# EAGLE schematic AdamOBrien_IOT2_PicController (EAGLE 9.6.2)

## Sheet 1 of 2
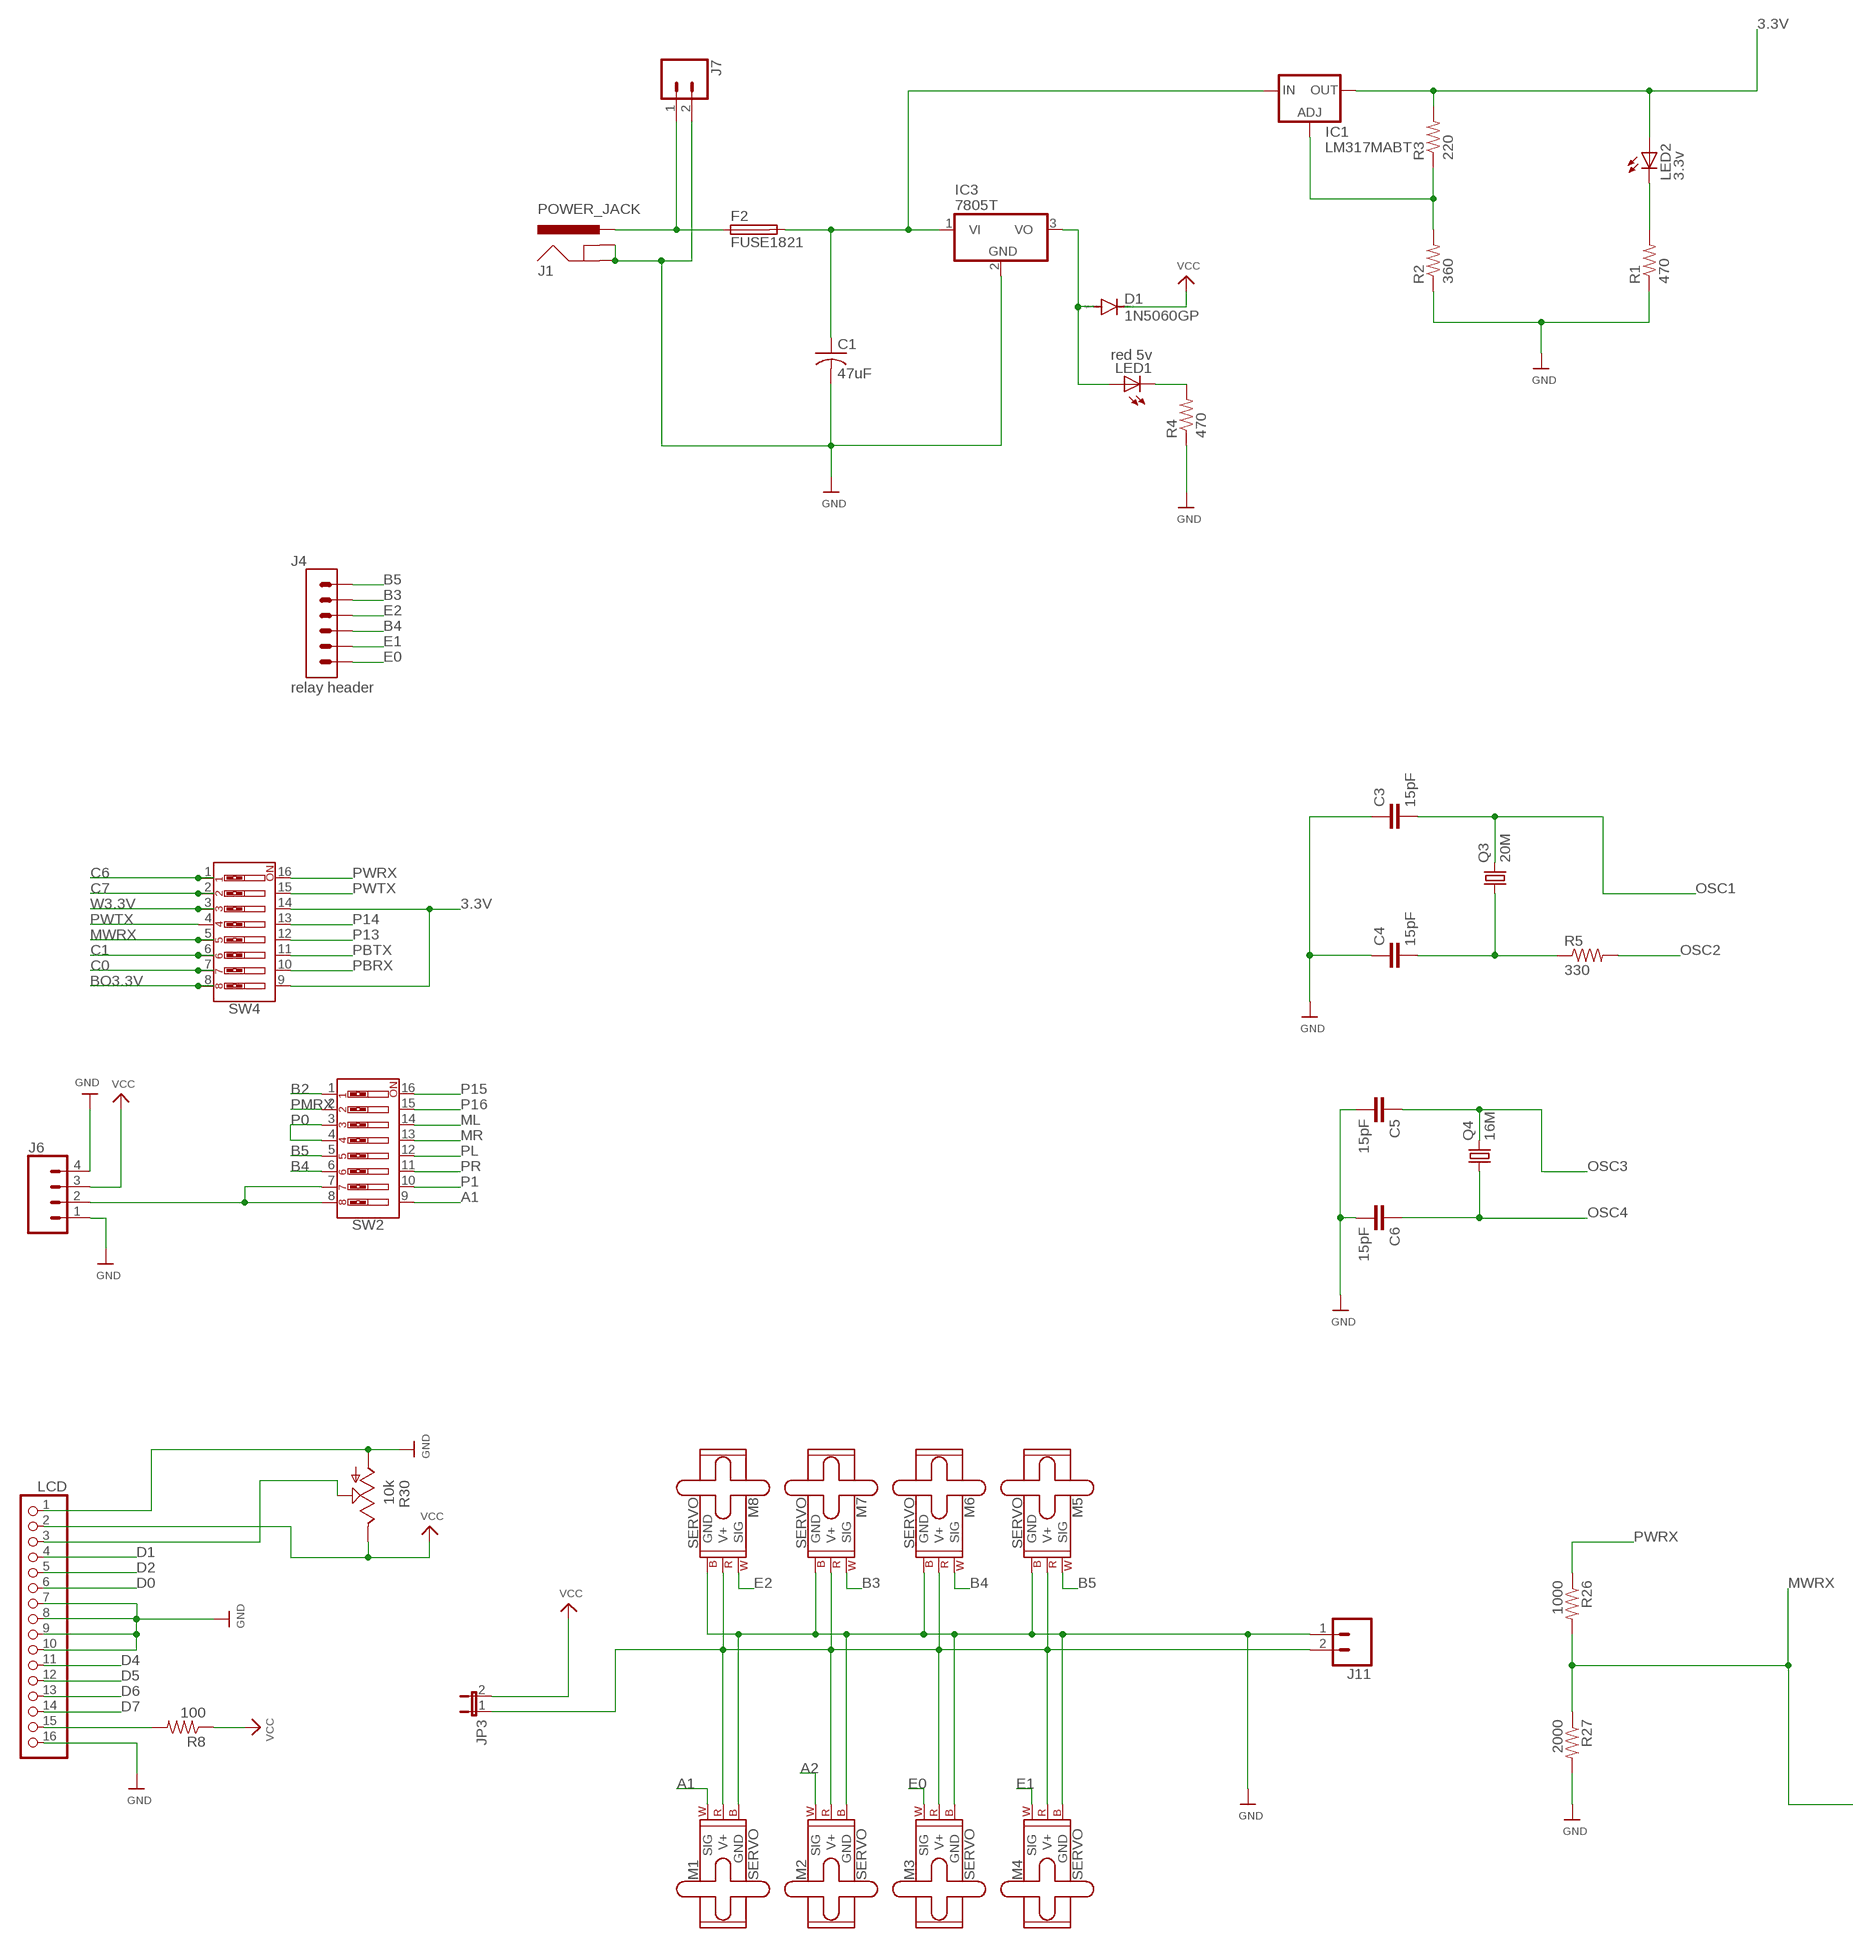
[diagram p0: schematic, sheet 1, part 1 of 2]
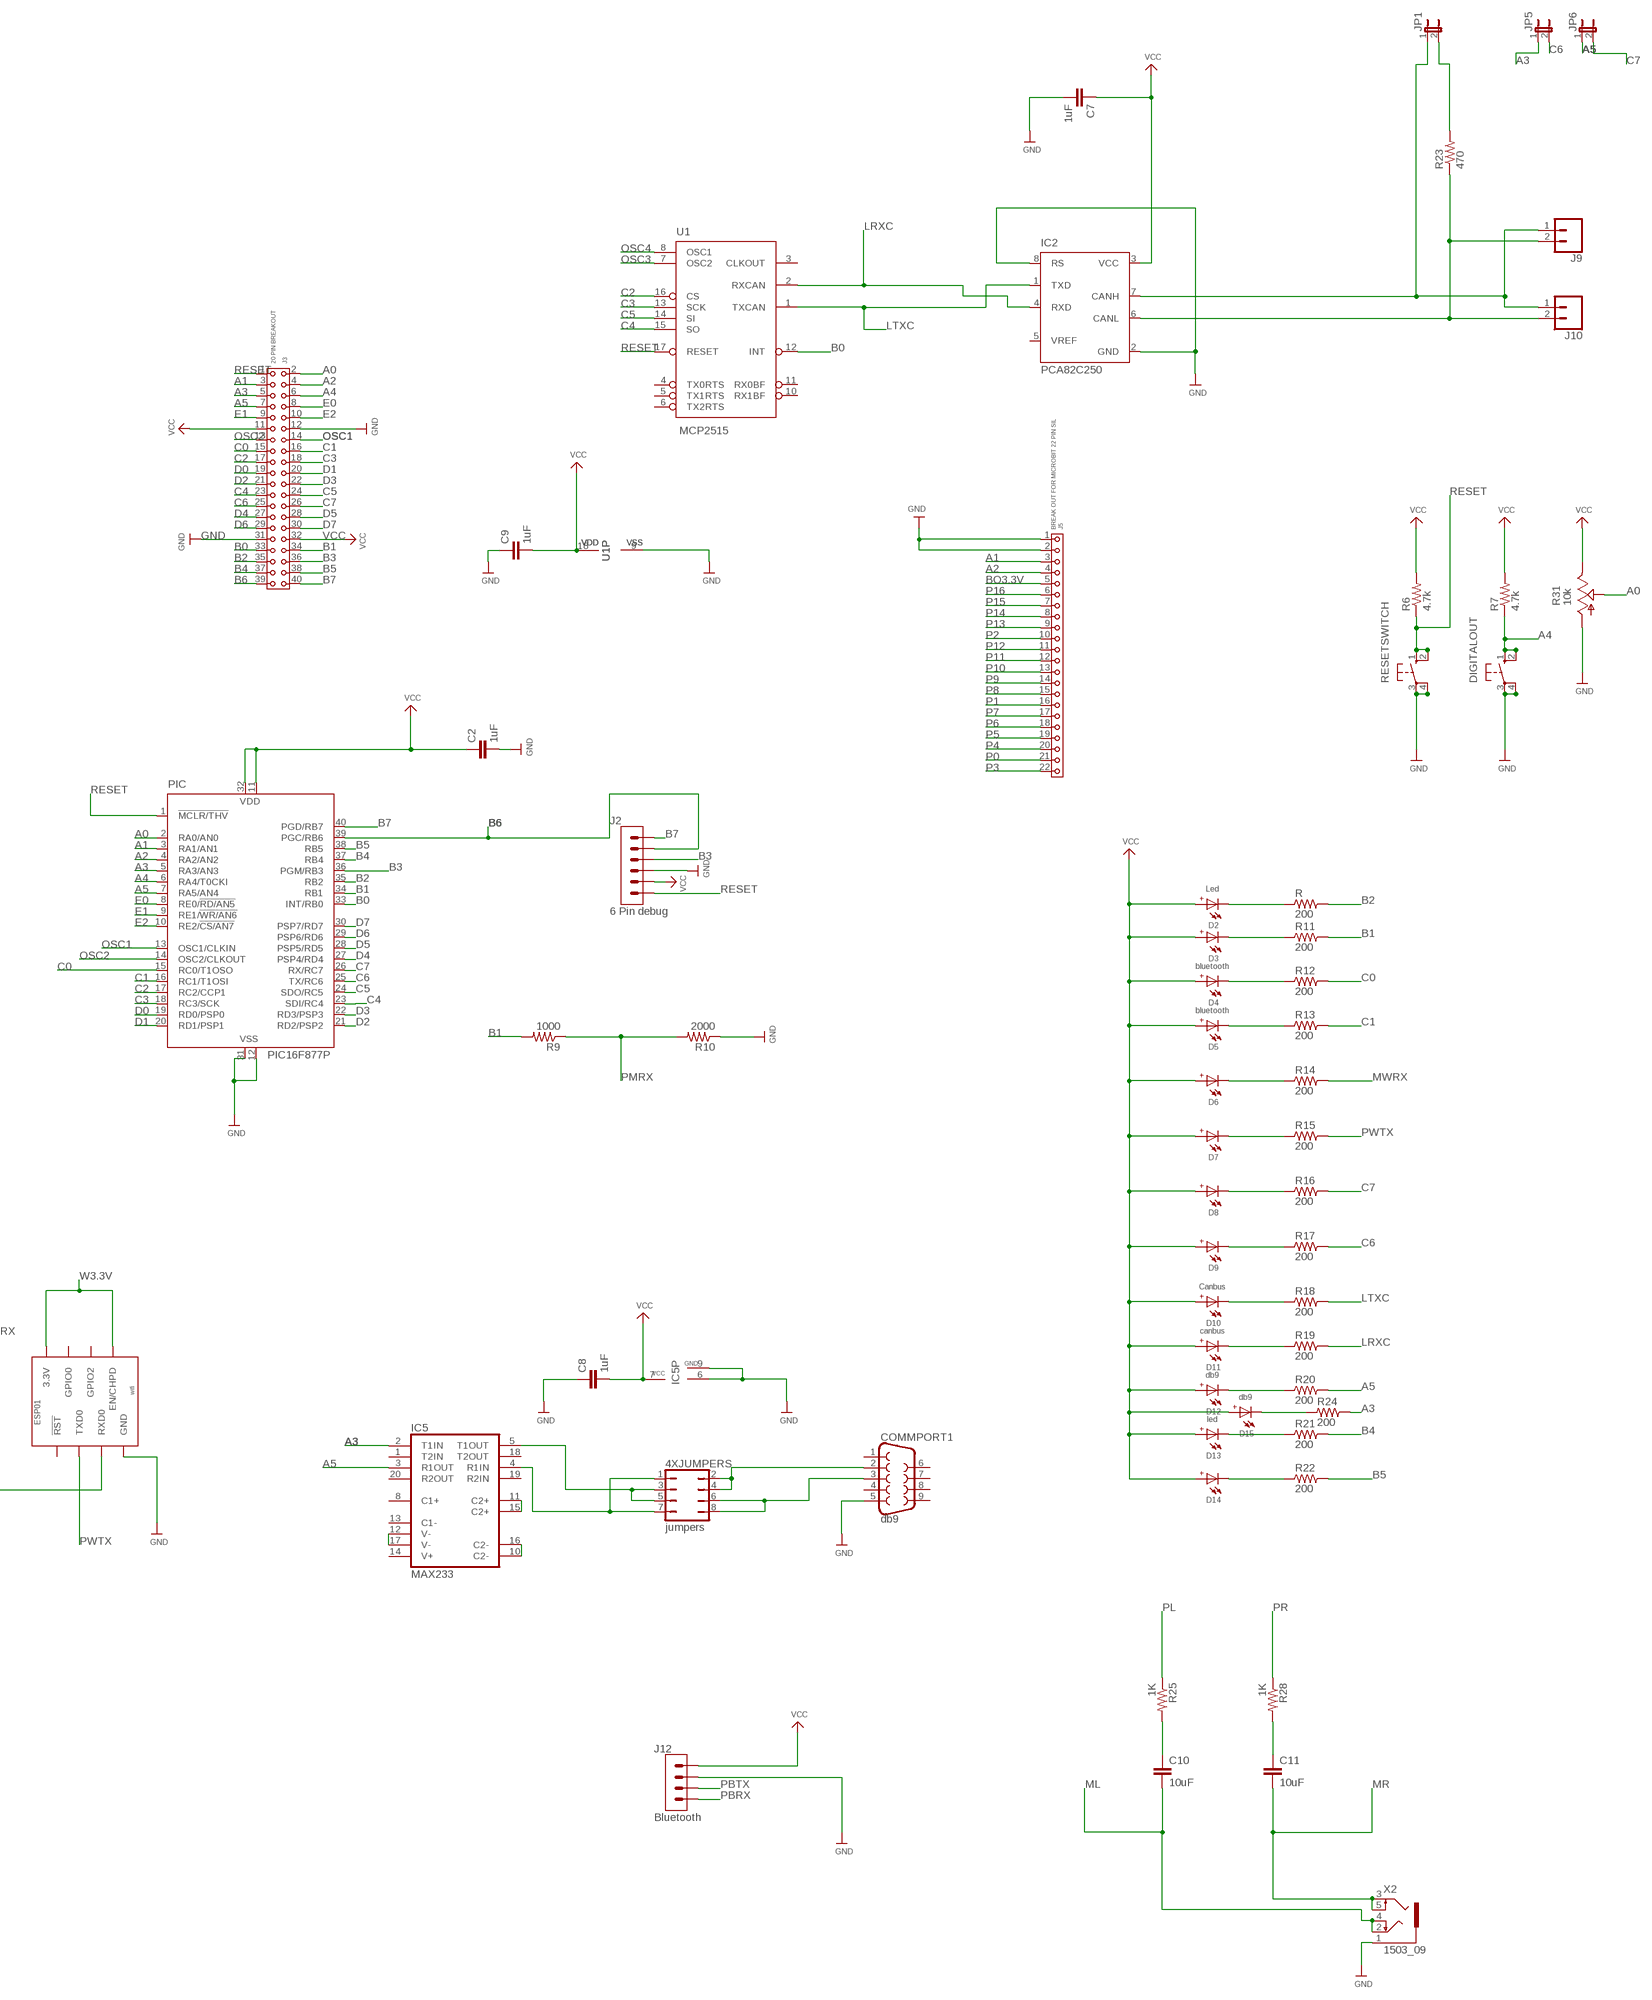
[diagram p1: schematic, sheet 1, part 2 of 2]

### Parts
4XJUMPERS  jumpers  JP4Q  [JP4Q]
C1  47uF  C-US025-024X044  [C025-024X044]
C2  1uF  C2.5/2  [C2.5-2]
C3  15pF  C2.5/2  [C2.5-2]
C4  15pF  C2.5/2  [C2.5-2]
C5  15pF  C2.5/2  [C2.5-2]
C6  15pF  C2.5/2  [C2.5-2]
C7  1uF  C2.5/2  [C2.5-2]
C8  1uF  C2.5/2  [C2.5-2]
C9  1uF  C2.5/2  [C2.5-2]
C10  10uF  C2.5/2  [C2.5-2]
C11  10uF  C2.5/2  [C2.5-2]
COMMPORT1  db9  DB9FEMALE  [DB9]
D1  1N5060GP  [DO15-12]
D2  Led  WL-SITW_3528_15414185BA210  [WL-SITW_3528]
D3  WL-SITW_3528_15414185BA210  [WL-SITW_3528]
D4  bluetooth  WL-SITW_3528_15414185BA210  [WL-SITW_3528]
D5  bluetooth  WL-SITW_3528_15414185BA210  [WL-SITW_3528]
D6  WL-SITW_3528_15414185BA210  [WL-SITW_3528]
D7  WL-SITW_3528_15414185BA210  [WL-SITW_3528]
D8  WL-SITW_3528_15414185BA210  [WL-SITW_3528]
D9  WL-SITW_3528_15414185BA210  [WL-SITW_3528]
D10  Canbus  WL-SITW_3528_15414185BA210  [WL-SITW_3528]
D11  canbus  WL-SITW_3528_15414185BA210  [WL-SITW_3528]
D12  db9  WL-SITW_3528_15414185BA210  [WL-SITW_3528]
D13  led  WL-SITW_3528_15414185BA210  [WL-SITW_3528]
D14  WL-SITW_3528_15414185BA210  [WL-SITW_3528]
D15  db9  WL-SITW_3528_15414185BA210  [WL-SITW_3528]
DIGITALOUT  10-XX  [B3F-10XX]
ESP01  wifi  ESP8266_ESP-01  [ESP8266_ESP-01_NO-SILKSCREEN]
F2  FUSE1821  [FUSE_HOLDER_MENTOR-1821]
IC1  LM317MABT  [TO220L1]
IC2  PCA82C250  [DIL08]
IC3  7805T  [TO220H]
IC5  MAX233  [DIL20]
J1  POWER_JACK  [POWER_JACK_PTH]
J2  6 Pin debug  62000611121  [62000611121]
J3  20 PIN BREAKOUT  6130XX21821_61304021821  [61304021821]
J4  relay header  62000611121  [62000611121]
J5  BREAK OUT FOR MICROBIT 22 PIN SIL  6130XX11821_61302211821  [61302211821]
J6  CONN_04  [1X04]
J7  CONN_025MM  [SCREWTERMINAL-5MM-2]
J9  CONN_025MM  [SCREWTERMINAL-5MM-2]
J10  CONN_025MM  [SCREWTERMINAL-5MM-2]
J11  CONN_025MM  [SCREWTERMINAL-5MM-2]
J12  Bluetooth  62000411121  [62000411121]
JP1  JP1E  [JP1]
JP3  JP1E  [JP1]
JP5  JP1E  [JP1]
JP6  JP1E  [JP1]
LCD  PINHD-1X16  [1X16]
LED1  red 5v  LED5MM  [LED5MM]
LED2  3.3v  LED5MM  [LED5MM]
M1  SERVO  [1X03]
M2  SERVO  [1X03]
M3  SERVO  [1X03]
M4  SERVO  [1X03]
M5  SERVO  [1X03]
M6  SERVO  [1X03]
M7  SERVO  [1X03]
M8  SERVO  [1X03]
PIC  PIC16F877P  [DIL40]
Q3  20M  CRYSTALHC49S  [HC49/S]
Q4  16M  CRYSTALHC49S  [HC49/S]
R  200  RC-MASTER-SMD_R_1206MP  [RC-MASTER-SMD_R1206MP]
R1  470  R-US_0204/7  [0204/7]
R2  360  R-US_0204/7  [0204/7]
R3  220  R-US_0204/7  [0204/7]
R4  470  R-US_0204/7  [0204/7]
R5  330  R-US_0204/7  [0204/7]
R6  4.7k  R-US_0204/7  [0204/7]
R7  4.7k  R-US_0204/7  [0204/7]
R8  100  R-US_0204/7  [0204/7]
R9  1000  R-US_0204/7  [0204/7]
R10  2000  R-US_0204/7  [0204/7]
R11  200  RC-MASTER-SMD_R_1206MP  [RC-MASTER-SMD_R1206MP]
R12  200  RC-MASTER-SMD_R_1206MP  [RC-MASTER-SMD_R1206MP]
R13  200  RC-MASTER-SMD_R_1206MP  [RC-MASTER-SMD_R1206MP]
R14  200  RC-MASTER-SMD_R_1206MP  [RC-MASTER-SMD_R1206MP]
R15  200  RC-MASTER-SMD_R_1206MP  [RC-MASTER-SMD_R1206MP]
R16  200  RC-MASTER-SMD_R_1206MP  [RC-MASTER-SMD_R1206MP]
R17  200  RC-MASTER-SMD_R_1206MP  [RC-MASTER-SMD_R1206MP]
R18  200  RC-MASTER-SMD_R_1206MP  [RC-MASTER-SMD_R1206MP]
R19  200  RC-MASTER-SMD_R_1206MP  [RC-MASTER-SMD_R1206MP]
R20  200  RC-MASTER-SMD_R_1206MP  [RC-MASTER-SMD_R1206MP]
R21  200  RC-MASTER-SMD_R_1206MP  [RC-MASTER-SMD_R1206MP]
R22  200  RC-MASTER-SMD_R_1206MP  [RC-MASTER-SMD_R1206MP]
R23  470  R-US_0204/7  [0204/7]
R24  200  RC-MASTER-SMD_R_1206MP  [RC-MASTER-SMD_R1206MP]
R25  1K  R-US_0204/7  [0204/7]
R26  1000  R-US_0204/7  [0204/7]
R27  2000  R-US_0204/7  [0204/7]
R28  1K  R-US_0204/7  [0204/7]
R30  10k  TRIM_US-RS3  [RS3]
R31  10k  TRIM_US-RS3  [RS3]
RESETSWITCH  10-XX  [B3F-10XX]
SW2  DIP-08-PTH  [DIPSWITCH-08]
SW4  DIP-08-PTH  [DIPSWITCH-08]
U1  MCP2515  MCP2515(MCP2510)P  [DIP18]
X2  1503_09  [1503_09]

### Nets
3.3V: IC1.2(OUT) LED2.A R3.2 SW4.9 SW4.14
A0: J3.2 PIC.2(RA0/AN0) R31.S
A1: J3.3 J5.3 M1.1(SIG) PIC.3(RA1/AN1) SW2.9
A2: J3.4 J5.4 M2.1(SIG) PIC.4(RA2/AN2)
A3: IC5.2(T1IN) J3.5 JP5.1 PIC.5(RA3/AN3) R24.2
A4: DIGITALOUT.1(S) DIGITALOUT.2(S1) J3.6 PIC.6(RA4/T0CKI) R7.1
A5: IC5.3(R1OUT) J3.7 JP6.1 PIC.7(RA5/AN4) R20.2
B0: J3.33 PIC.33(INT/RB0) U1.12(INT)
B1: J3.34 PIC.34(RB1) R9.2 R11.2
B2: J3.35 PIC.35(RB2) R.2 SW2.1
B3: J2.3 J3.36 J4.2 M7.1(SIG) PIC.36(PGM/RB3)
B4: J3.37 J4.4 M6.1(SIG) PIC.37(RB4) R21.2 SW2.6
B5: J3.38 J4.1 M5.1(SIG) PIC.38(RB5) R22.2 SW2.5
B6: J2.2 J3.39 PIC.39(PGC/RB6)
B7: J2.1 J3.40 PIC.40(PGD/RB7)
BO3.3V: J5.5 SW4.8
C0: J3.15 PIC.15(RC0/T1OSO) R12.2 SW4.7
C1: J3.16 PIC.16(RC1/T1OSI) R13.2 SW4.6
C2: J3.17 PIC.17(RC2/CCP1) U1.16(CS)
C3: J3.18 PIC.18(RC3/SCK) U1.13(SCK)
C4: J3.23 PIC.23(SDI/RC4) U1.15(SO)
C5: J3.24 PIC.24(SDO/RC5) U1.14(SI)
C6: J3.25 JP5.2 PIC.25(TX/RC6) R17.2 SW4.1
C7: J3.26 JP6.2 PIC.26(RX/RC7) R16.2 SW4.2
D0: J3.19 LCD.6 PIC.19(RD0/PSP0)
D1: J3.20 LCD.4 PIC.20(RD1/PSP1)
D2: J3.21 LCD.5 PIC.21(RD2/PSP2)
D3: J3.22 PIC.22(RD3/PSP3)
D4: J3.27 LCD.11 PIC.27(PSP4/RD4)
D5: J3.28 LCD.12 PIC.28(PSP5/RD5)
D6: J3.29 LCD.13 PIC.29(PSP6/RD6)
D7: J3.30 LCD.14 PIC.30(PSP7/RD7)
E0: J3.8 J4.6 M3.1(SIG) PIC.8(RE0/!RD/AN5)
E1: J3.9 J4.5 M4.1(SIG) PIC.9(RE1/!WR/AN6)
E2: J3.10 J4.3 M8.1(SIG) PIC.10(RE2/!CS/AN7)
GND: C1.2 C2.2 C3.1 C4.1 C5.2 C6.2 C7.2 C8.1 C9.1 COMMPORT1.5 DIGITALOUT.3(P) DIGITALOUT.4(P1) ESP01.GND IC2.2(GND) IC2.8(RS) IC3.2(GND) IC5.6(GND) IC5.9(GND) J1.GND J1.GNDBREAK J2.4 J3.12 J3.31 J5.1 J5.2 J6.1 J6.4 J7.2 J11.1 J12.2 LCD.1 LCD.7 LCD.8 LCD.9 LCD.10 LCD.16 M1.3(GND) M2.3(GND) M3.3(GND) M4.3(GND) M5.3(GND) M6.3(GND) M7.3(GND) M8.3(GND) PIC.12(VSS) PIC.31(VSS) R1.1 R2.1 R4.1 R10.1 R27.2 R30.A R31.A RESETSWITCH.3(P) RESETSWITCH.4(P1) U1.9(VSS) X2.1
LRXC: IC2.4(RXD) R19.2 U1.2(RXCAN)
LTXC: IC2.1(TXD) R18.2 U1.1(TXCAN)
ML: C10.2 SW2.14 X2.2 X2.4
MR: C11.2 SW2.13 X2.3 X2.5
MWRX: ESP01.RX(RXD0) R14.2 R26.2 R27.1 SW4.5
N$1: F2.A J1.PWR J7.1
N$2: C1.1 F2.B IC1.3(IN) IC3.1(VI)
N$3: LED1.K(C) R4.2
N$4: J6.2 SW2.7 SW2.8
N$5: LED2.K(C) R1.2
N$6: D1.A IC3.3(VO) LED1.A
N$7: IC1.1(ADJ) R2.2 R3.1
N$8: C4.2 Q3.1 R5.1
N$9: IC2.7(CANH) J9.1 J10.1 JP1.1
N$10: D2.2(-) R.1
N$11: D3.2(-) R11.1
N$12: JP1.2 R23.2
N$13: D4.2(-) R12.1
N$15: LCD.3 R30.S
N$16: D5.2(-) R13.1
N$17: LCD.15 R8.2
N$18: D15.2(-) R24.1
N$19: D6.2(-) R14.1
N$25: D7.2(-) R15.1
N$27: D8.2(-) R16.1
N$28: C10.1 R25.2
N$29: D9.2(-) R17.1
N$33: D10.2(-) R18.1
N$41: D11.2(-) R19.1
N$42: D12.2(-) R20.1
N$43: D13.2(-) R21.1
N$44: D14.2(-) R22.1
N$46: IC2.6(CANL) J9.2 J10.2 R23.1
N$47: 4XJUMPERS.6 4XJUMPERS.8 COMMPORT1.3
N$48: 4XJUMPERS.2 4XJUMPERS.4 COMMPORT1.2
N$49: 4XJUMPERS.3 4XJUMPERS.5 IC5.5(T1OUT)
N$50: J11.2 JP3.1 M1.2(V+) M2.2(V+) M3.2(V+) M4.2(V+) M5.2(V+) M6.2(V+) M7.2(V+) M8.2(V+)
N$52: 4XJUMPERS.1 4XJUMPERS.7 IC5.4(R1IN)
N$53: IC5.11(C2+) IC5.15(C2+)
N$54: IC5.10(C2-) IC5.16(C2-)
N$55: IC5.12(V-) IC5.17(V-)
N$57: C11.1 R28.2
OSC1: C3.2 J3.14 PIC.13(OSC1/CLKIN) Q3.2
OSC2: J3.13 PIC.14(OSC2/CLKOUT) R5.2
OSC3: C5.1 Q4.2 U1.7(OSC2)
OSC4: C6.1 Q4.1 U1.8(OSC1)
P0: J5.21 SW2.3 SW2.4
P1: J5.16 SW2.10
P2: J5.10
P3: J5.22
P4: J5.20
P5: J5.19
P6: J5.18
P7: J5.17
P8: J5.15
P9: J5.14
P10: J5.13
P11: J5.12
P12: J5.11
P13: J5.9 SW4.12
P14: J5.8 SW4.13
P15: J5.7 SW2.16
P16: J5.6 SW2.15
PBRX: J12.4 SW4.10
PBTX: J12.3 SW4.11
PL: R25.1 SW2.12
PMRX: R9.1 R10.2 SW2.2
PR: R28.1 SW2.11
PWRX: R26.1 SW4.16
PWTX: ESP01.TX(TXD0) R15.2 SW4.4 SW4.15
RESET: J2.6 J3.1 PIC.1(!MCLR/THV) R6.1 RESETSWITCH.1(S) RESETSWITCH.2(S1) U1.17(RESET)
VCC: C2.1 C7.1 C8.2 C9.2 D1.C D2.1(+) D3.1(+) D4.1(+) D5.1(+) D6.1(+) D7.1(+) D8.1(+) D9.1(+) D10.1(+) D11.1(+) D12.1(+) D13.1(+) D14.1(+) D15.1(+) IC2.3(VCC) IC5.7(VCC) J2.5 J3.11 J3.32 J6.3 J12.1 JP3.2 LCD.2 PIC.11(VDD) PIC.32(VDD) R6.2 R7.2 R8.1 R30.E R31.E U1.18(VDD)
W3.3V: ESP01.3V3(3.3V) ESP01.EN/CH_PD(EN/CHPD) SW4.3
Unconnected: COMMPORT1.1 COMMPORT1.4 COMMPORT1.6 COMMPORT1.7 COMMPORT1.8 COMMPORT1.9 ESP01.GPIO0 ESP01.GPIO2 ESP01.RST(!RST!) IC2.5(VREF) IC5.1(T2IN) IC5.8(C1+) IC5.13(C1-) IC5.14(V+) IC5.18(T2OUT) IC5.19(R2IN) IC5.20(R2OUT) U1.3(CLKOUT) U1.4(TX0RTS) U1.5(TX1RTS) U1.6(TX2RTS) U1.10(RX1BF) U1.11(RX0BF)

## Sheet 2 of 2

## Library data of the parts
4XJUMPERS = jumper:JP4Q: JUMPER
C1 = adafruit:C-US: CAPACITOR, American symbol
C2-C11 = capacitor-wima:C: CAPACITOR naming: grid - package width
COMMPORT1 = SparkFun-Connectors:DB9: DB9 Connector Standard DB9 (D-Sub 9) serial connector. Can be used for CAN bus as well as RS485 and RS232. Footprint production proven. Here is the female version connector we sell at SparkFun: 9 Pin Female Serial Connector - PCB Mount <https://www.sparkfun.com/products/429> (PRT-00429) This connector has been used on the following SparkFun products: SparkFun RS232 Shifter - SMD <https://www.sparkfun.com/products/449> (PRT-00449) SparkFun RS232 Shifter SMD (No DB9) <https://www.sparkfun.com/products/8780> (PRT-08780); PROD_ID: CONN-08194
D1 = diode:1N5060GP: DIODE controlled avalanche rectifier
D2-D15 = Wurth_Infrared_WL-SITW:WL-SITW_3528: WL-SITW SMT Infrared TOP LED Waterclear Characteristics Standard size 3528 Low energy consumption High reliability Low current requirement Fast switching IR Emitter Applications Infrared sensor Distance measure Remote control IR Lightbarrier Smoke detector <https://www.we-online.com/catalog/media/o121487v209%20Family_SITW-3528_15414185BA220.jpg> Details see: https://www.we-online.com/catalog/en/WL-SITW/ Updated By Yingchun Shan 2020-03-24 2020 (C) Wurth Elektronik; ABSTRAHLWINKEL: 120°; CHIP-TECHNOLOGY: AlGaAs; DATASHEET-URL: https://www.we-online.com/catalog/datasheet/15414185BA210.pdf; EMITTING-COLOR: Infrared; H: 1.9mm; I-E-MIN: 5mW/sr; I-E-TYP: 9mW/sr; LAMDA-CENTROLD-TYP: 845nm; LAMDA-PEAK-TYP: 850nm; PART-NUMBER: 15414185BA210; V-F-MAX: 2V; V-F-TYP: 1.5V
DIGITALOUT RESETSWITCH = switch-omron:10-XX: OMRON SWITCH; MPN: B3F-1000; OC_FARNELL: 176432; OC_NEWARK: 36M3542
ESP01 = LuisLab-Boards:ESP8266_ESP-?
F2 = fuse:FUSE: Fuse; OC_FARNELL: unknown; OC_NEWARK: unknown
IC1 = v-reg:LM317?*: 500 mA Adjustable Output Positive Voltage Regulator Source: http://www.onsemi.co.jp .. LM317M-D.PDF
IC2 = micro-philips:PCA82C250: CAN CONTROLLER INTERFACE; OC_FARNELL: 3692358; OC_NEWARK: unknown
IC3 = linear:78*: Positive VOLTAGE REGULATOR Source: http://cache.national.com/ds/LM/LM78L05.pdf http://www.fairchildsemi.com/ds/LM/LM7805.pdf
IC5 = maxim:MAX233: RS232 TRANSCEIVER; MPN: MAX233ACPP+G36; OC_FARNELL: 1593332; OC_NEWARK: 89K3459
J1 = SparkFun-Connectors:POWER_JACK: Power Jack Connector This is the standard 5.5mm barrel jack for power. The PTH is the most common, proven, reliable, footprint. The Slot footprint only works if the mill layer is transmitted to the PCB fab house so be warned. Here are the connectors we sell at SparkFun: DC Barrel Power Jack/Connector <https://www.sparkfun.com/products/119> (PRT-00119) DC Barrel Power Jack/Connector (SMD) <https://www.sparkfun.com/products/12748> (PRT-12748) DC Barrel Jack Adapter - Breadboard Compatible <https://www.sparkfun.com/products/10811> (PRT-10811) It is used on this SparkFun product (and many, many others): SparkFun RedBoard - Programmed with Arduino <https://www.sparkfun.com/products/12757> (DEV-12757) Also, if you need a mating power supply or connector, please check these out: Wall Adapter Power Supply - 9VDC 650mA <https://www.sparkfun.com/products/298> (TOL-00298) DC Barrel Jack Adapter - Male <https://www.sparkfun.com/products/10287> (PRT-10287); PROD_ID: CONN-08197
J2 J4 = Headers:62000611121: THT Vertical Pin Header WR-PHD, Pitch 2.00 mm, Single Row, 6 pins Manufacturer's datasheet <https://datasheet.octopart.com/62000611121-W%C3%BCrth-Elektronik-datasheet-117282008.pdf>; CREATED_BY: PCBLayout.com; MANUFACTURER: Würth Elektronik; MPN: 62000611121
J3 = Wurth_Connectors_WR-PHD:6130XX21821_61304021821: WR-PHD 2.54 mm Dual Socket Header ARTICLE PROPERTIES: Pins:4;​ 6;​ 8;​ 10;​ 12;​ 14;​ 16;​ 18;​ 20;​ 22;​ 24;​ 26;​ 28;​ 30;​ 32;​ 34;​ 36;​ 40;​ 44;​ 64;​ 72 KIND PROPERTIES: Pitch：2.54 mm Quality Class:3 as per CECC 75 301-802 Rows：Dual Gender：Socket Header Type：Straight MATERIAL PROPERTIES: Insulator Material :PBT Insulator Flammability Rating:UL94 V-0 Contact Material:Copper Alloy Contact Plating:Gold Contact Type:Stamped GENERAL INFORMATION Operating Temperature:-40 up to +125 °C Compliance:Lead free / RoHS ELECTRICAL PROPERTIES: Rated Current:3 A IR 1:3 A Withstanding Voltage:500 V (AC) Contact Resistance:20 mΩ RISO:1000 MΩ CERTIFICATION UL Approval:E323964 PACKAGING PROPERTIES Packaging:Tray <https://katalog.we-online.com/media/images/v2/o57948v209%20Family_Dual_Socket_Header_WR-PHD_6130xx21821.jpg> Details see: https://katalog.we-online.com/en/em/PHD_2_54_DUAL_SOCKET_HEADER_6130XX21821 Updated by Yingchun,Shan 2019-10-21 2019 (C) Würth Elektronik; DATASHEET-URL: https://katalog.we-online.com/em/datasheet/61304021821.pdf; GENDER: Socket Header; IR: 3A; MATES: WR-PHD 2.54mm SMT Dual Pin Header/THT Angled Dual Pin Header/THT Dual Board Stacker/THT Dual Pin Header; PACKAGING: Tray; PART-NUMBER: 61304021821; PINS: 40; ROWS: Dual; TYPE: Straight
J5 = Wurth_Connectors_WR-PHD:6130XX11821_61302211821: WR-PHD 2.54 mm Socket Header ARTICLE PROPERTIES: Pins:1;​ 2;​ 3;​ 4;​ 5;​ 6;​ 7;​ 8;​ 9;​ 10;​ 12;​ 13;​ 14;​ 15;​ 16;​ 18;​ 20;​ 22;​ 24;​ 25;​ 32;​ 36;​ 40 KIND PROPERTIES: Pitch：2.54 mm Quality Class:3 as per CECC 75 301-802 Rows：Single Gender：Socket Header;​ Female Type：Straight MATERIAL PROPERTIES: Insulator Material :PBT Insulator Flammability Rating:UL94 V-0 Contact Material:Copper Alloy Contact Plating:Gold Contact Type:Stamped GENERAL INFORMATION Operating Temperature:-40 up to +125 °C Compliance:Lead free / RoHS ELECTRICAL PROPERTIES: Rated Current:3 A IR 1:3 A Withstanding Voltage:500 V (AC) Contact Resistance:20 mΩ RISO:1000 MΩ CERTIFICATION UL Approval:E323964 PACKAGING PROPERTIES Packaging:Tray <https://katalog.we-online.com/media/images/v2/o33218v209%20Family_WR-PHD_613xxx11821.jpg> Details see: https://katalog.we-online.com/en/em/PHD_2_54_SOCKET_HEADER_6130XX11821 Updated by Yingchun,Shan 2019-10-21 2019 (C) Würth Elektronik; DATASHEET-URL: https://katalog.we-online.com/em/datasheet/61302211821.pdf; GENDER: Socket Header; IR: 3A; MATES: WR-PHD 2.54mm SMT Pin Header/THT Angled Pin Header/THT Pin Header; PACKAGING: Tray; PART-NUMBER: 61302211821; PINS: 22; ROWS: Single; TYPE: Straight
J6 = SparkFun-Connectors:CONN_04: Multi connection point. Often used as Generic Header-pin footprint for 0.1 inch spaced/style header connections On any of the 0.1 inch spaced packages, you can populate with these: Break Away Headers - Straight <https://www.sparkfun.com/products/116> (PRT-00116) Break Away Male Headers - Right Angle <https://www.sparkfun.com/products/553> (PRT-00553) Female Headers <https://www.sparkfun.com/products/115> (PRT-00115) Break Away Headers - Machine Pin <https://www.sparkfun.com/products/117> (PRT-00117) Break Away Female Headers - Swiss Machine Pin <https://www.sparkfun.com/products/743> (PRT-00743) For SCREWTERMINALS and SPRING TERMINALS visit here: Screw Terimnals on SparkFun.com <https://www.sparkfun.com/search/results?term=Screw+Terminals> (5mm/3.5mm/2.54mm spacing) This device is also useful as a general connection point to wire up your design to another part of your project. Our various solder wires solder well into these plated through hole pads. Hook-Up Wire - Assortment (Stranded, 22 AWG) <https://www.sparkfun.com/products/11375> (PRT-11375) Hook-Up Wire - Assortment (Solid Core, 22 AWG) <https://www.sparkfun.com/products/11367> (PRT-11367) View the entire wire category on our website here <https://www.sparkfun.com/categories/141> Special notes: Molex polarized connector foot print use with SKU : PRT-08231 with associated crimp pins and housings. 1MM SMD Version SKU: PRT-10208; PROD_ID: CONN-09696
J7 J9-J11 = SparkFun-Connectors:CONN_02: Multi connection point. Often used as Generic Header-pin footprint for 0.1 inch spaced/style header connections On any of the 0.1 inch spaced packages, you can populate with these: Break Away Headers - Straight <https://www.sparkfun.com/products/116> (PRT-00116) Break Away Male Headers - Right Angle <https://www.sparkfun.com/products/553> (PRT-00553) Female Headers <https://www.sparkfun.com/products/115> (PRT-00115) Break Away Headers - Machine Pin <https://www.sparkfun.com/products/117> (PRT-00117) Break Away Female Headers - Swiss Machine Pin <https://www.sparkfun.com/products/743> (PRT-00743) For SCREWTERMINALS and SPRING TERMINALS visit here: Screw Terimnals on SparkFun.com <https://www.sparkfun.com/search/results?term=Screw+Terminals> (5mm/3.5mm/2.54mm spacing) This device is also useful as a general connection point to wire up your design to another part of your project. Our various solder wires solder well into these plated through hole pads. Hook-Up Wire - Assortment (Stranded, 22 AWG) <https://www.sparkfun.com/products/11375> (PRT-11375) Hook-Up Wire - Assortment (Solid Core, 22 AWG) <https://www.sparkfun.com/products/11367> (PRT-11367) View the entire wire category on our website here <https://www.sparkfun.com/categories/141> Special notes: Molex polarized connector foot print use with: PRT-08233 with associated crimp pins and housings. 2.54_SCREWTERM for use with PRT-10571. 3.5mm Screw Terminal footprints for PRT-08084 5mm Screw Terminal footprints for use with PRT-08432; SF_SKU: PRT-08432
J12 = Headers:62000411121: THT Vertical Pin Header WR-PHD, Pitch 2.00 mm, Single Row, 4 pins Manufacturer's datasheet <https://datasheet.octopart.com/62000411121-W%C3%BCrth-Elektronik-datasheet-117282003.pdf>; CREATED_BY: PCBLayout.com; MANUFACTURER: Würth Elektronik; MPN: 62000411121
JP1 JP3 JP5 JP6 = jumper:JP1E: JUMPER
LCD = pinhead:PINHD-1X16: PIN HEADER
LED1 LED2 = adafruit:LED: LED OSRAM: - CHIPLED LG R971, LG N971, LY N971, LG Q971, LY Q971, LO R971, LY R971 LH N974, LH R974 LS Q976, LO Q976, LY Q976 LO Q996 - Hyper CHIPLED LW Q18S LB Q993, LB Q99A, LB R99A - SideLED LS A670, LO A670, LY A670, LG A670, LP A670 LB A673, LV A673, LT A673, LW A673 LH A674 LY A675 LS A676, LA A676, LO A676, LY A676, LW A676 LS A679, LY A679, LG A679 - Hyper Micro SIDELED® LS Y876, LA Y876, LO Y876, LY Y876 LT Y87S - SmartLED LW L88C, LW L88S LB L89C, LB L89S, LG L890 LS L89K, LO L89K, LY L89K LS L896, LA L896, LO L896, LY L896 - TOPLED LS T670, LO T670, LY T670, LG T670, LP T670 LSG T670, LSP T670, LSY T670, LOP T670, LYG T670 LG T671, LOG T671, LSG T671 LB T673, LV T673, LT T673, LW T673 LH T674 LS T676, LA T676, LO T676, LY T676, LB T676, LH T676, LSB T676, LW T676 LB T67C, LV T67C, LT T67C, LS T67K, LO T67K, LY T67K, LW E67C LS E67B, LA E67B, LO E67B, LY E67B, LB E67C, LV E67C, LT E67C LW T67C LS T679, LY T679, LG T679 LS T770, LO T770, LY T770, LG T770, LP T770 LB T773, LV T773, LT T773, LW T773 LH T774 LS E675, LA E675, LY E675, LS T675 LS T776, LA T776, LO T776, LY T776, LB T776 LHGB T686 LT T68C, LB T68C - Hyper Mini TOPLED® LB M676 - Mini TOPLED Santana® LG M470 LS M47K, LO M47K, LY M47K Source: http://www.osram.convergy.de/
M1-M8 = SparkFun-Electromechanical:SERVO: Servo Motor 3-pin connector for a standard servo motor (voltage supply, ground, and control signal.) SparkFun Products Servo - Generic (Sub-Micro Size) <https://www.sparkfun.com/products/9065> (ROB-09065) Servo - Generic High Torque Continuous Rotation (Standard Size) <https://www.sparkfun.com/products/9347> (ROB-09347) Servo - Generic High Torque (Standard Size) <https://www.sparkfun.com/products/11965> (ROB-11965)
PIC = microchip:PIC16F87*: MICROCONTROLLER; MF: MICROCHIP; MPN: PIC16F877-04/P; OC_FARNELL: 9761349; OC_NEWARK: 61K3463
Q3 Q4 = adafruit:CRYSTAL: CRYSTAL; OC_FARNELL: 1667008; OC_NEWARK: unknown
R R11-R22 R24 = 52101-101-REV-A_v16:RC-MASTER-SMD_R_: RESISTOR
R1-R10 R23 R25-R28 = adafruit:R-US_: RESISTOR, American symbol
R30 R31 = pot:TRIM_US-: POTENTIOMETER
SW2 SW4 = SparkFun-Switches:DIP-08: 8-Position DIP Switch 8-circuit DIP (dual inline package) switch. Commonly used to physcially set a circuit's behavior. SparkFun Products DIP Switch - 8 Position <https://www.sparkfun.com/products/8034> (COM-08034); PROD_ID: SWCH-12197; SF_SKU: COM-08034
U1 = SparkFun-IC-Comms:MCP2515(MCP2510): CAN controller with SPI interface The MCP2515 controller supercedes the MCP2510 while addressing all errata associated with it. The two devices are pin compatible, either can be used with this device. 18-pin package SOIC Simple SPI interface to any MCU. One-shot mode ensures message transmission is attempted only once Databyte filtering Start-of-Frame (SOF) output Low-power CMOS Technology Datasheet <http://www.sparkfun.com/datasheets/DevTools/Arduino/MCP2515.pdf> SparkFun Products CAN-BUS Shield <https://www.sparkfun.com/products/13262> (DEV-13262); PROD_ID: NA-XXXXX
X2 = con-lumberg:1503_09: Jack connectors according to JISC 6560, 3.5 mm Klinkeneinbaukupplung nach JISC 6560, 3,5 mm, 3-polig/ stereo, abgewinkelte Ausführung, mit 2 Öffnern und Lötaugen, für Leiterplatten Rückseitenmontage Source: http://www.lumberg.com/Produkte/PDFs/1503_09.pdf; OC_FARNELL: 1243244; OC_NEWARK: unknown